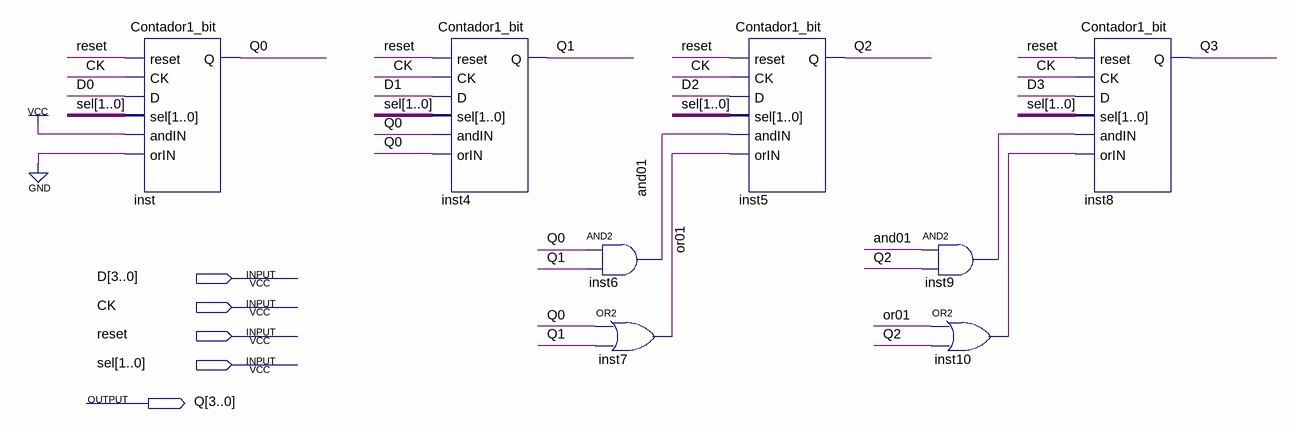
[diagram p0: schematic sheet]
// Quartus schematic Contador4_bits.bdf as structural Verilog: 8 symbols, 5 pins
module Contador4_bits (
  input  [3:0] D,
  input  CK,
  input  reset,
  input  [1:0] sel,
  output [3:0] Q
);

  wire and01, inst9_out, inst10_out, or01;

  Contador1_bit inst (.reset(reset), .CK(CK), .D(D[0]), .sel(sel), .andIN(1'b1), .orIN(1'b0), .Q(Q[0]));
  Contador1_bit inst4 (.reset(reset), .CK(CK), .D(D[1]), .sel(sel), .andIN(Q[0]), .orIN(Q[0]), .Q(Q[1]));
  and inst6 (and01, Q[0], Q[1]);
  or inst7 (or01, Q[0], Q[1]);
  Contador1_bit inst5 (.reset(reset), .CK(CK), .D(D[2]), .sel(sel), .andIN(and01), .orIN(or01), .Q(Q[2]));
  and inst9 (inst9_out, and01, Q[2]);
  or inst10 (inst10_out, or01, Q[2]);
  Contador1_bit inst8 (.reset(reset), .CK(CK), .D(D[3]), .sel(sel), .andIN(inst9_out), .orIN(inst10_out), .Q(Q[3]));
endmodule
